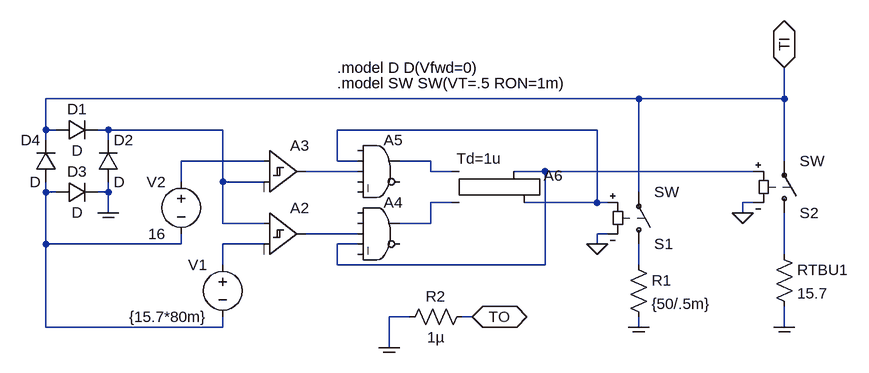
[diagram p0: schematic TBUg.asc]
TBUg.asc, the LTspice schematic file:
Version 4
SHEET 1 1072 732
WIRE 432 -48 -480 -48
WIRE 656 -48 656 -96
WIRE 656 -48 432 -48
WIRE -480 0 -480 -48
WIRE -464 0 -480 0
WIRE -384 0 -400 0
WIRE -208 0 -384 0
WIRE 368 0 -32 0
WIRE -480 16 -480 0
WIRE -384 16 -384 0
WIRE -144 48 -272 48
WIRE -32 48 -32 0
WIRE 0 48 -32 48
WIRE 112 48 64 48
WIRE 656 48 656 -48
WIRE 0 64 -80 64
WIRE 112 64 112 48
WIRE 144 64 112 64
WIRE 288 64 240 64
WIRE 608 64 288 64
WIRE -272 80 -272 48
WIRE -208 80 -208 0
WIRE -144 80 -208 80
WIRE -480 96 -480 80
WIRE -464 96 -480 96
WIRE -384 96 -384 80
WIRE -384 96 -400 96
WIRE 432 96 432 -48
WIRE 144 112 112 112
WIRE 368 112 368 0
WIRE 368 112 256 112
WIRE 384 112 368 112
WIRE 608 112 592 112
WIRE -384 128 -384 96
WIRE 592 128 592 112
WIRE -208 144 -208 80
WIRE -144 144 -208 144
WIRE 112 144 112 112
WIRE 112 144 64 144
WIRE 0 160 -80 160
WIRE 384 160 368 160
WIRE -480 176 -480 96
WIRE -272 176 -272 160
WIRE -272 176 -480 176
WIRE -144 176 -208 176
WIRE 0 176 -32 176
WIRE 368 176 368 160
WIRE 656 192 656 128
WIRE -208 208 -208 176
WIRE -32 208 -32 176
WIRE 288 208 288 64
WIRE 288 208 -32 208
WIRE 432 208 432 176
WIRE 80 288 48 288
WIRE 176 288 160 288
WIRE -480 304 -480 176
WIRE -208 304 -208 288
WIRE -208 304 -480 304
WIRE 432 304 432 288
WIRE 656 304 656 272
WIRE 48 336 48 288
FLAG 368 176 0
FLAG 432 304 COM
FLAG 592 128 0
FLAG 656 304 COM
FLAG 656 -96 TI
IOPIN 656 -96 BiDir
FLAG 176 288 TO
IOPIN 176 288 BiDir
FLAG 48 336 COM
FLAG -384 128 COM
SYMBOL res 640 176 R0
SYMATTR InstName RTBU1
SYMATTR Value 15.7
SYMBOL Digital\\diffschmtbuf -144 96 R0
WINDOW 3 8 120 Invisible 2
SYMATTR Value VT=0
SYMATTR InstName A2
SYMBOL Digital\\diffschmtbuf -144 0 R0
WINDOW 3 8 120 Invisible 2
SYMATTR Value VT=0
SYMATTR InstName A3
SYMBOL voltage -208 192 M0
SYMATTR InstName V1
SYMATTR Value {15.7*80m}
SYMBOL voltage -272 64 M0
SYMATTR InstName V2
SYMATTR Value 16
SYMBOL sw 432 192 M180
SYMATTR InstName S1
SYMBOL sw 656 144 M180
SYMATTR InstName S2
SYMBOL res 416 192 R0
SYMATTR InstName R1
SYMATTR Value {50/.5m}
SYMBOL Digital\\and 32 96 R0
SYMATTR InstName A4
SYMBOL Digital\\and 32 0 R0
SYMATTR InstName A5
SYMBOL Digital\\srflop 192 16 R0
WINDOW 3 -40 28 Left 2
SYMATTR Value Td=1u
SYMATTR InstName A6
SYMBOL res 64 304 R270
WINDOW 0 32 56 VTop 2
WINDOW 3 0 56 VBottom 2
SYMATTR InstName R2
SYMATTR Value 1µ
SYMBOL diode -464 16 R270
WINDOW 0 32 32 VTop 2
WINDOW 3 0 32 VBottom 2
SYMATTR InstName D1
SYMBOL diode -400 80 M180
WINDOW 0 24 64 Left 2
WINDOW 3 24 0 Left 2
SYMATTR InstName D2
SYMBOL diode -464 80 M90
WINDOW 0 0 32 VBottom 2
WINDOW 3 32 32 VTop 2
SYMATTR InstName D3
SYMBOL diode -464 80 R180
WINDOW 0 24 64 Left 2
WINDOW 3 24 0 Left 2
SYMATTR InstName D4
TEXT -32 -72 Left 2 !.model SW SW(VT=.5 RON=1m)
TEXT -32 -96 Left 2 !.model D D(Vfwd=0)

The netlist it stands for:
* TBUg.asc
RTBU1 N011 COM 15.7
A2 N001 N010 0 0 0 0 N009 0 SCHMITT VT=0
A3 N003 N001 0 0 0 0 N005 0 SCHMITT VT=0
V1 N010 N007 {15.7*80m}
V2 N003 N007 16
S1 N012 TI N002 0 SW
S2 N011 TI N006 0 SW
R1 N012 COM {50/.5m}
A4 0 0 N009 N006 0 0 N008 0 AND
A5 0 N002 N005 0 0 0 N004 0 AND
A6 N004 N008 0 0 0 N002 N006 0 SRFLOP Td=1u
R2 COM TO 1µ
D1 TI N001 D
D2 COM N001 D
D3 N007 COM D
D4 N007 TI D
.model D D
.lib standard.dio
.model SW SW(VT=.5 RON=1m)
.model D D(Vfwd=0)
.backanno
.end